# Altium schematic sheet fullSchematic.SchDoc
size A3
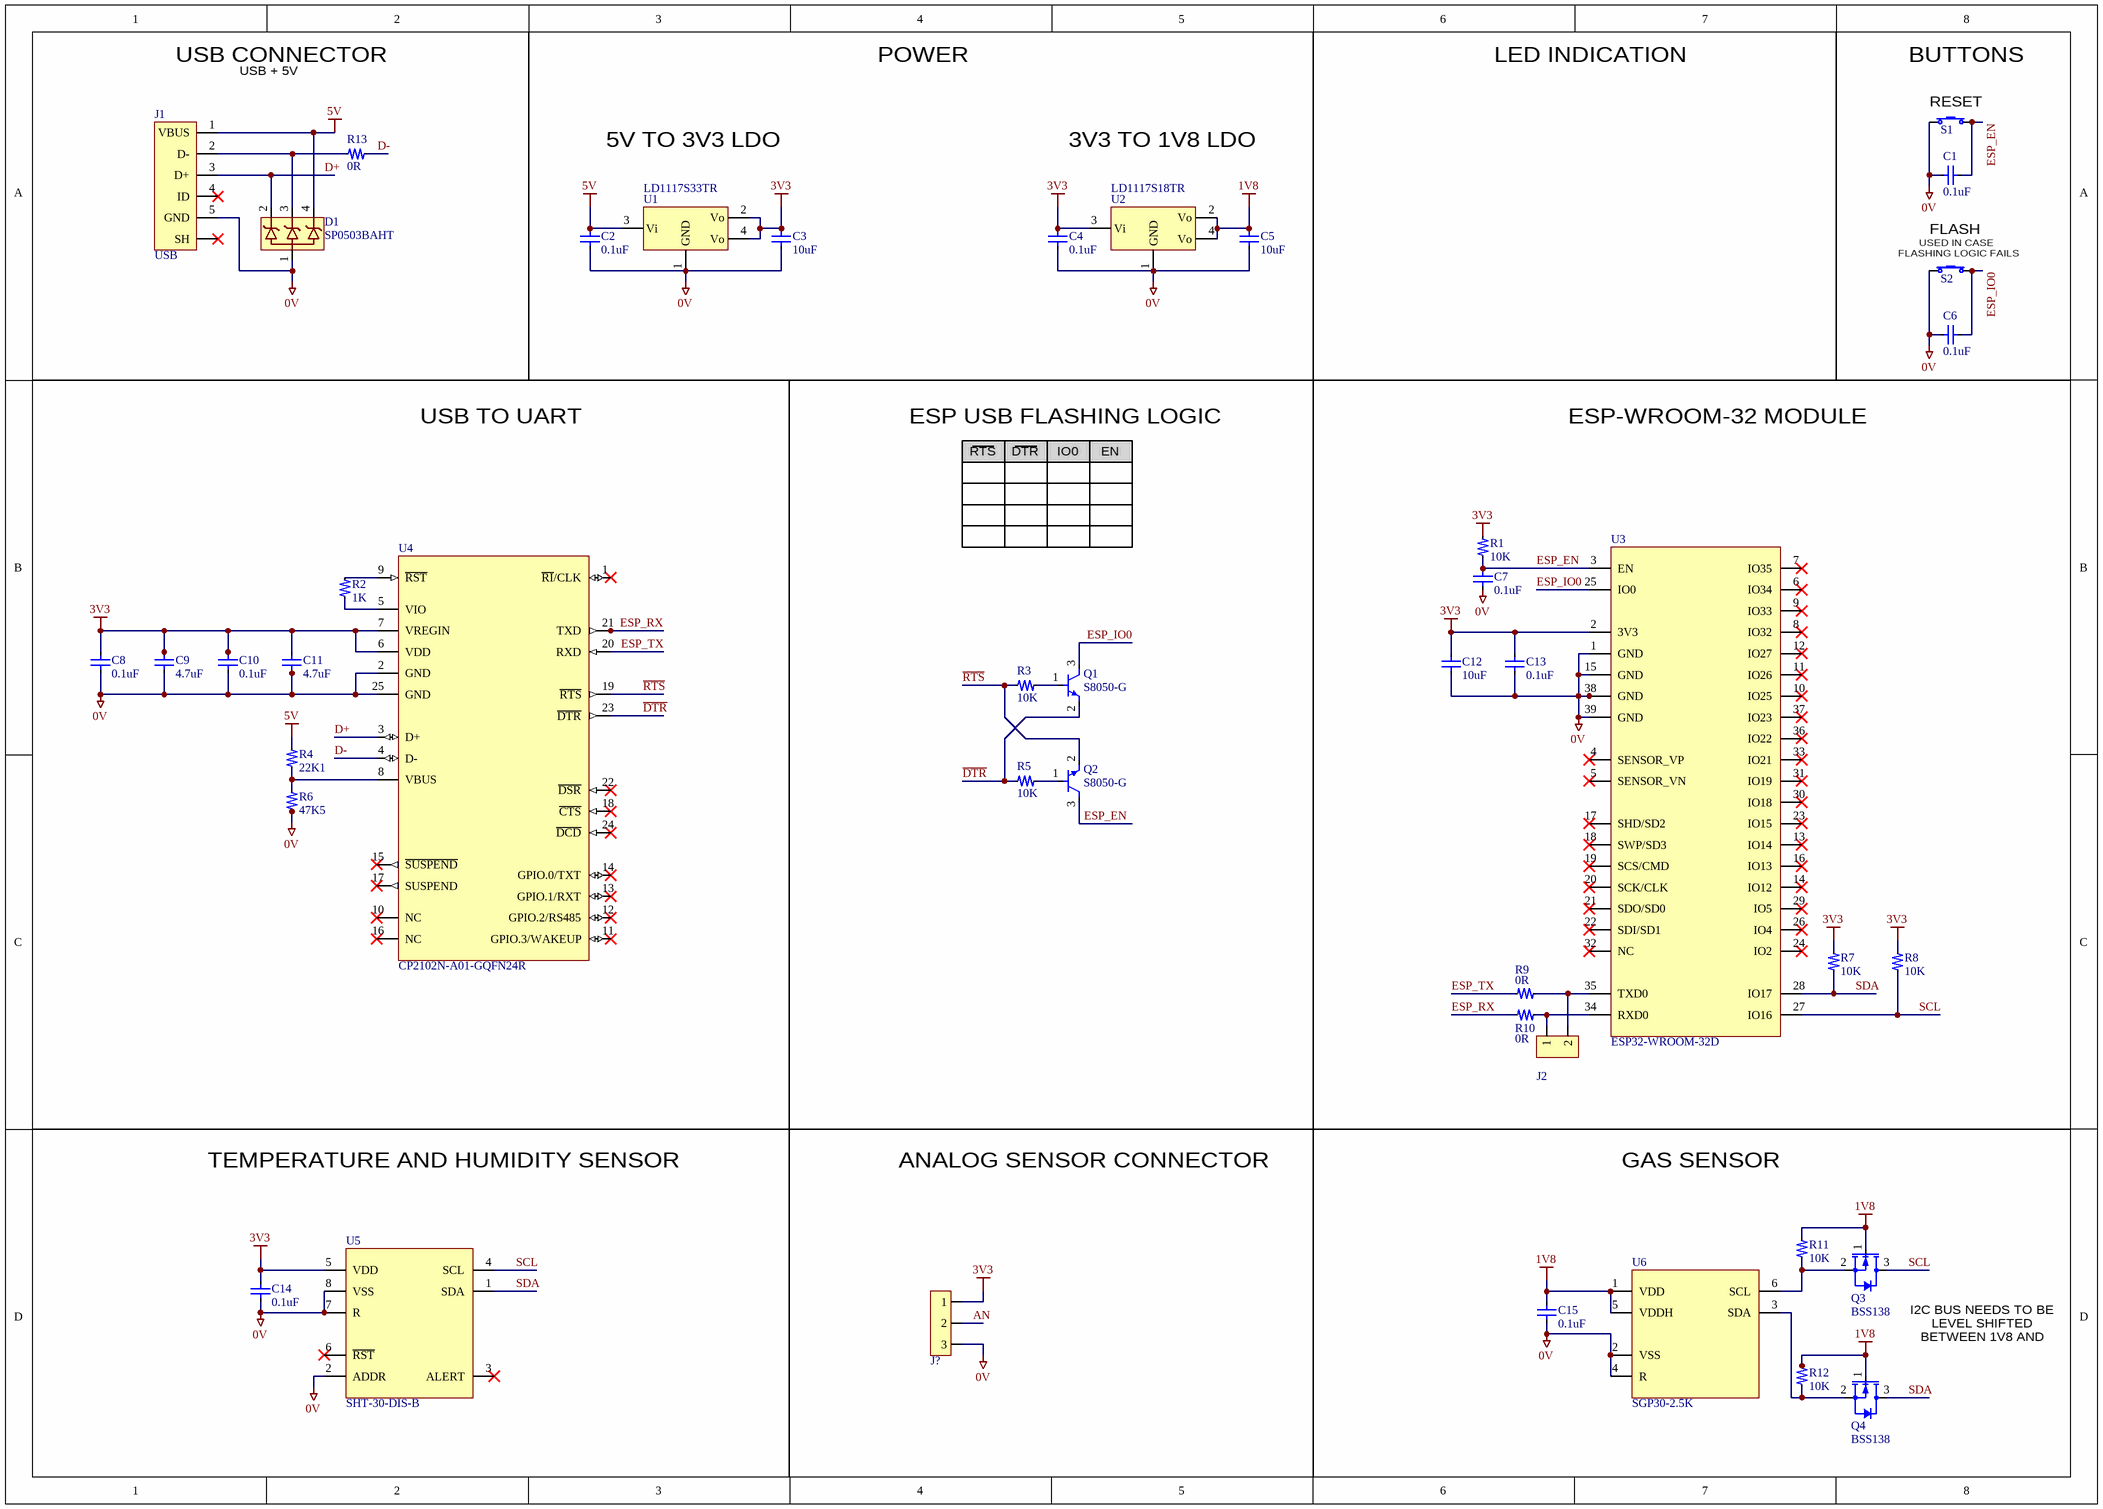
[diagram p0: fullSchematic.SchDoc]

## Parts
C1  0.1uF  [Capacitor_0603]
C2  0.1uF  [Capacitor_0603]
C3  10uF  [Capacitor_0603]
C4  0.1uF  [Capacitor_0603]
C5  10uF  [Capacitor_0603]
C6  0.1uF  [Capacitor_0603]
C7  0.1uF  [Capacitor_0603]
C8  0.1uF  [Capacitor_0603]
C9  4.7uF  [Capacitor_0603]
C10  0.1uF  [Capacitor_0603]
C11  4.7uF  [Capacitor_0603]
C12  10uF  [Capacitor_0603]
C13  0.1uF  [Capacitor_0603]
C14  0.1uF  [Capacitor_0603]
C15  0.1uF  [Capacitor_0603]
D1  SP0503BAHT  [SOT-143]
J1  USB  [CON_uUSB_DRILL]
J2  Con_Gen_2Pos  [Pin Header 1x2 TH Pitch 2.54mm]  (value not drawn)
J?  Con_Duraclik_3pos_horizontal  [Duraclik_3pin_horizontal]  (value not drawn)
Q1  S8050-G  [SOT-23-3]
Q2  S8050-G  [SOT-23-3]
Q3  BSS138  [SOT-23-3]
Q4  BSS138  [SOT-23-3]
R1  10K  [Resistor_0603]
R2  1K  [Resistor_0603]
R3  10K  [Resistor_0603]
R4  22K1  [Resistor_0603]
R5  10K  [Resistor_0603]
R6  47K5  [Resistor_0603]
R7  10K  [Resistor_0603]
R8  10K  [Resistor_0603]
R9  0R  [Resistor_0603]
R10  0R  [Resistor_0603]
R11  10K  [Resistor_0603]
R12  10K  [Resistor_0603]
R13  0R  [Resistor_0603]
S1  FSMSMTR  [FSMSMTR]  (value not drawn)
S2  FSMSMTR  [FSMSMTR]  (value not drawn)
U1  LD1117S33TR  [SOT-223]
U2  LD1117S18TR  [SOT-223]
U3  ESP32-WROOM-32D  [ESP_WROOM_32D]
U4  CP2102N-A01-GQFN24R  [SLAB-QFN-24-2550x2550TP_A_V]
U5  SHT-30-DIS-B  [SHT3x_8-VFDFN_Exposed_Pad]
U6  SGP30-2.5K  [SGP30-2.5k]

## Nets
0V: C1.2 C2.1 C3.2 C4.1 C5.1 C6.2 C7.1 C8.1 C9.1 C10.1 C11.1 C12.1 C13.1 C14.1 C15.1 D1.1 J1.5(GND) J?.3 R6.2 S1.1 S2.1 U1.1(GND) U2.1(GND) U3.1(GND) U3.15(GND) U3.38(GND) U3.39(GND) U4.2(GND) U4.25(GND) U5.2(ADDR) U5.7(R) U5.8(VSS) U6.2(VSS) U6.4(R)
1V8: C5.2 C15.2 Q3.1(G) Q4.1(G) R11.2 R12.2 U2.2(Vo) U2.4(Vo) U6.1(VDD) U6.5(VDDH)
3V3: C3.1 C4.2 C8.2 C9.2 C10.2 C11.2 C12.2 C13.2 C14.2 J?.1 R1.2 R7.2 R8.2 U1.2(Vo) U1.4(Vo) U2.3(Vi) U3.2(3V3) U4.6(VDD) U4.7(VREGIN) U5.5(VDD)
5V: C2.2 D1.4 J1.1(VBUS) R4.1 U1.3(Vi)
AN: J?.2
D+: D1.2 J1.3(D+) U4.3(D+)
D-: R13.2 U4.4(D-)
~{DTR}: Q1.2(E) R5.2 U4.23(~{DTR})
ESP_EN: C1.1 C7.2 Q2.3(C) R1.1 S1.2 U3.3(EN)
ESP_IO0: C6.1 Q1.3(C) S2.2 U3.25(IO0)
ESP_RX: R10.1 U4.21(TXD)
ESP_TX: R9.1 U4.20(RXD)
~{RTS}: Q2.2(E) R3.2 U4.19(~{RTS})
SCL: Q3.3(D) R8.1 U3.27(IO16) U5.4(SCL)
SDA: Q4.3(D) R7.1 U3.28(IO17) U5.1(SDA)
NetD1_3: D1.3 J1.2(D-) R13.1
NetJ2_1: J2.1 R10.2 U3.34(RXD0)
NetJ2_2: J2.2 R9.2 U3.35(TXD0)
NetQ1_1: Q1.1(B) R3.1
NetQ2_1: Q2.1(B) R5.1
NetQ3_2: Q3.2(S) R11.1 U6.6(SCL)
NetQ4_2: Q4.2(S) R12.1 U6.3(SDA)
NetR2_1: R2.1 U4.9(~{RST})
NetR2_2: R2.2 U4.5(VIO)
NetR4_2: R4.2 R6.1 U4.8(VBUS)

Not connected (* = marked no-connect by the designer): J1 4(ID)* SH*; U3 4(SENSOR_VP)* 5(SENSOR_VN)* 6(IO34)* 7(IO35)* 8(IO32)* 9(IO33)* 10(IO25)* 11(IO26)* 12(IO27)* 13(IO14)* 14(IO12)* 16(IO13)* 17(SHD/SD2)* 18(SWP/SD3)* 19(SCS/CMD)* 20(SCK/CLK)* 21(SDO/SD0)* 22(SDI/SD1)* 23(IO15)* 24(IO2)* 26(IO4)* 29(IO5)* 30(IO18)* 31(IO19)* 32(NC)* 33(IO21)* 36(IO22)* 37(IO23)*; U4 1(~{RI}/CLK)* 10(NC)* 11(GPIO.3/WAKEUP)* 12(GPIO.2/RS485)* 13(GPIO.1/RXT)* 14(GPIO.0/TXT)* 15(~{SUSPEND})* 16(NC)* 17(SUSPEND)* 18(~{CTS})* 22(~{DSR})* 24(~{DCD})*; U5 3(ALERT)* 6(~{RST})*

## Notes on the sheet
- USB CONNECTOR
- USB + 5V
- POWER
- LED INDICATION
- (near S1) BUTTONS
- (near S1) RESET
- 5V TO 3V3 LDO
- 3V3 TO 1V8 LDO
- (near S2) USED IN CASE
- FLASH
- (near S2) FLASHING LOGIC FAILS
- USB TO UART
- ESP USB FLASHING LOGIC
- RTS
- DTR
- IO0
- EN
- ESP-WROOM-32 MODULE
- TEMPERATURE AND HUMIDITY SENSOR
- ANALOG SENSOR CONNECTOR
- GAS SENSOR
- I2C BUS NEEDS TO BE LEVEL SHIFTED BETWEEN 1V8 AND 3V3.

## Library data of the parts
C1-C15 = Capacitor: Generic capacitor symbol; Manufacturer: Murata; Manufacturer Part Number: GCM188R71C104KA37D; Tolerance: 10%; Capacitance: 100nF; Voltage Rating: 16V; Dielectric: X7R; Supplier 1: Digi-Key; Stock 1: 40000; Pricing 1: 1=0.1, 10=0.076, 100=0.0341, 500=0.0243, 1000=0.0191 (USD); Mount: Surface Mount; Case/Package: 0603; Case Code (Metric): 1608; Case Code (Imperial): 0603; Min Operating Temperature: -55°C; Max Operating Temperature: 125°C; Packaging: Tape and Reel; Package Quantity: 4000; Voltage Rating (DC): 16V; Termination: SMD/SMT; Voltage: 16V; Length: 1.6mm; Height: 0.8mm; Width: 0.031inch; Thickness: 0.035inch; Depth: 0.8mm; Ratings: AEC-Q200; Radiation Hardening: No; REACH SVHC: No SVHC; Lead Free: Lead Free; Supplier Part Number 1: 490-4774-1-ND
D1 = Diode_USB-TVS: 3 channel TVS diode - SP0503BAHT; Supplier 1: Digi-Key; Supplier Part Number 1: F2715CT-ND
J1 = Con_USB_5pos+Shield: USB 2.0 Connector, Shielded
J2 = Con_Gen_2Pos: 2 position connector
J? = Con_Duraclik_3pos_horizontal: 3 position connector
Q1 Q2 = NPN: NPN Transistor 1.5A 40V SOT-23 R - S8050-G; Supplier 1: Digi-Key; Supplier Part Number 1: 641-1790-1-ND
Q3 Q4 = MFET_Nch: MOSFET N-CH 50V 220MA SOT-23; Supplier 1: Digi-Key; Supplier Part Number 1: BSS138DKR-ND
R1-R13 = Resistor: Generic resistor symbol
S1 S2 = Switch_2lead: 2 lead switch - FSMSMTR; Supplier 1: Digi-Key; Supplier Part Number 1: 450-1758-1-ND
U1 = LDO_3V3: Fixed 3V3 output LDO LD1117S33TR; Supplier 1: Digi-Key; Supplier Part Number 1: 497-1242-1-ND
U2 = LDO_1V8: Fixed 1V8 output LDO LD1117S18TR; Supplier 1: Digi-Key; Supplier Part Number 1: 497-7308-1-ND
U3 = ESP32_WROOM: ESP32 Module; Supplier 1: Mouser; Supplier Part Number 1: 356-ESP32WROOM-32D
U4 = CP2102N-QFN24: BRIDGE USB TO UART 24QFN; Supplier 1: Digi-Key; Supplier Part Number 1: 336-4737-1-ND
U5 = SHT-30: SENSOR HUMID/TEMP 5V I2C 3% SMD; Supplier 1: Digi-Key; Supplier Part Number 1: 1649-1009-1-ND
U6 = SGP-30: SENSOR AIR QUALITY 2V I2C SMD; Supplier 1: Digi-Key; Supplier Part Number 1: 1649-1084-1-ND